# Altium schematic sheet Button.SchDoc: Button Module
size 292 x 193 mm; SheetNumber: 1; SheetTotal: 1
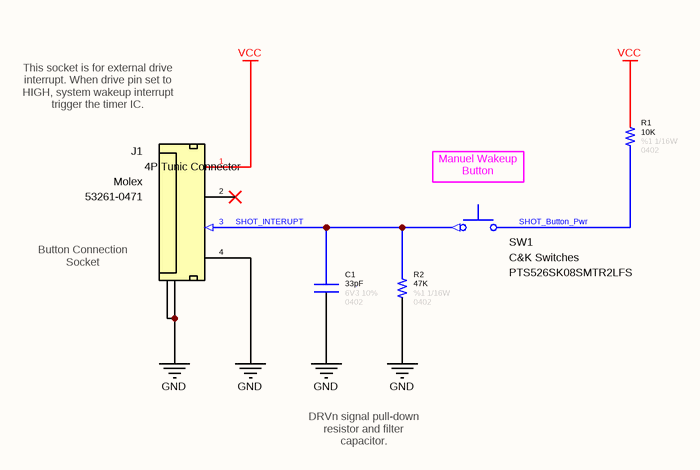
[diagram p0: Button.SchDoc]

## Parts
C1  value 33pF  Tolerance: 10%  Case: 0402  Voltage: 6V3  [CAPACITOR_0402]  (hidden comment: Capacitor - 33pF [0402] (Ceramic))
J1  Manufacturer Name: Molex  Manufacturer Part Number: 53261-0471  [Connector_Tunic 4P]  (hidden comment: 4P SMD Tunic Connector)
R1  value 10K  Tolerance: %1  Case: 0402  Power: 1/16W  [RESISTOR_0402]  (hidden comment: 10K - 0402 - %1 - 1/16W)
R2  value 47K  Tolerance: %1  Case: 0402  Power: 1/16W  [RESISTOR_0402]  (hidden comment: 47K - 0402 - %1 - 1/16W)
SW1  Manufacturer Name: C&K Switches  [PTS526_Switch]  (hidden comment: PTS526SK08SMTR2LFS)

## Nets
GND: C1.1 J1.4(Pin-4) J1.5(GND) J1.6(GND) R2.1
VCC: J1.1(Pin-1) R1.2
SHOT_Button_Pwr: R1.1 SW1.2(COM)
SHOT_INTERUPT: C1.2 J1.3(Pin-3) R2.2 SW1.1(NC)

Not connected (* = marked no-connect by the designer): J1 2(Pin-2)*

## Notes on the sheet
- (near J1) This socket is for external drive interrupt. When drive pin set to HIGH, system wakeup interrupt trigger the timer IC.
- (near SW1) Manuel Wakeup Button
- (near J1) Button Connection
  Socket
- DRVn signal pull-down resistor and filter capacitor.
- © 2021 All rights reserved.
  This document may not, in whole or in part, be copied, photocopied, reproduced, translated or converted to any electronic or machine readable from without prior written permission of Mehmet Günce Akkoyun.
  Engineer contact : akkoyun@me.com
- Property of
- Engineer :
- Date :
- Size :
- A4
- Time :
- Project :
- Page :
- /
- Customer :
- Product ID :
- Module ID :
- Version :
- File :
- Revision :
- (in symbol Connector - Mini Tunic 4P (1.25)) 4P Tunic Connector

## Library data of the parts
C1 = Capacitor - 33pF [0402-6V3]: Manufacturer Name: Kemet; Manufacturer Part Number: C0402C330J9RACAUTO; ComponentLink1Description: DataSheet; ComponentLink1URL: https://api.kemet.com/component-edge/download/datasheet/C0402C330J9RACAUTO.pdf; ComponentLink2Description: Mouser; ComponentLink2URL: https://www.mouser.com/Search/Refine.aspx?Keyword=80-C0402C330J9RAUTO
J1 = Connector - Mini Tunic 4P (1.25): Mini Tunic Connector with 4P; Pitch: 1.25mm; Position: 4; ROHS: Yes; ComponentLink1Description: DataSheet; ComponentLink1URL: https://www.mouser.com.tr/datasheet/2/276/0532610471_PCB_HEADERS-170942.pdf; ComponentLink2Description: Mouser; ComponentLink2URL: https://www.mouser.com.tr/ProductDetail/Molex/53261-0471?qs=%2Fha2pyFaduhLhIsk8tywtK7BwWtguBSP4XxyDBTOTfs%3D; Case: SMD
R1 = Resistor - 10K [0402]: Thick Film Resistors - SMD 1/16 W 10 KOhm 1%; Manufacturer Name: Vishay; Manufacturer Part Number: CRCW040210K0FKED; ComponentLink1Description: DataSheet; ComponentLink1URL: https://www.mouser.com.tr/datasheet/2/427/dcrcwe3-1762152.pdf; ComponentLink2Description: Mouser; ComponentLink2URL: https://www.mouser.com.tr/ProductDetail/Vishay-Dale/CRCW040210K0FKED?qs=sGAEpiMZZMu61qfTUdNhG2DpbjADlD3GcalbOv9utCY%3D
R2 = Resistor - 47K [0402]: Thick Film Resistors - SMD 1/16 W 47 KOhm 1%; Manufacturer Name: Vishay; Manufacturer Part Number: CRCW040247K0FKED; ComponentLink1Description: DataSheet; ComponentLink1URL: https://www.mouser.com.tr/datasheet/2/427/dcrcwe3-1762152.pdf; ComponentLink2Description: Mouser; ComponentLink2URL: https://www.mouser.com.tr/ProductDetail/Vishay-Dale/CRCW040247K0FKED?qs=sGAEpiMZZMu61qfTUdNhG2DpbjADlD3GL%252B3h1elTxqU%3D
SW1 = Switch - Push Button: Switch Tactile N.O. SPST Flush Round Button Gull Wing 0.05A 12VDC 200000Cycles 2.45N SMD T/R; Current Rating: 50 mA; Contact Form: SPST; Product Type: Tactile Switches; RoHS: Yes; Voltage Rating: 12 VDC; Case: SMD; Manufacturer Part Number: PTS526SK08SMTR2LFS